# Altium project PLL.PrjPcb
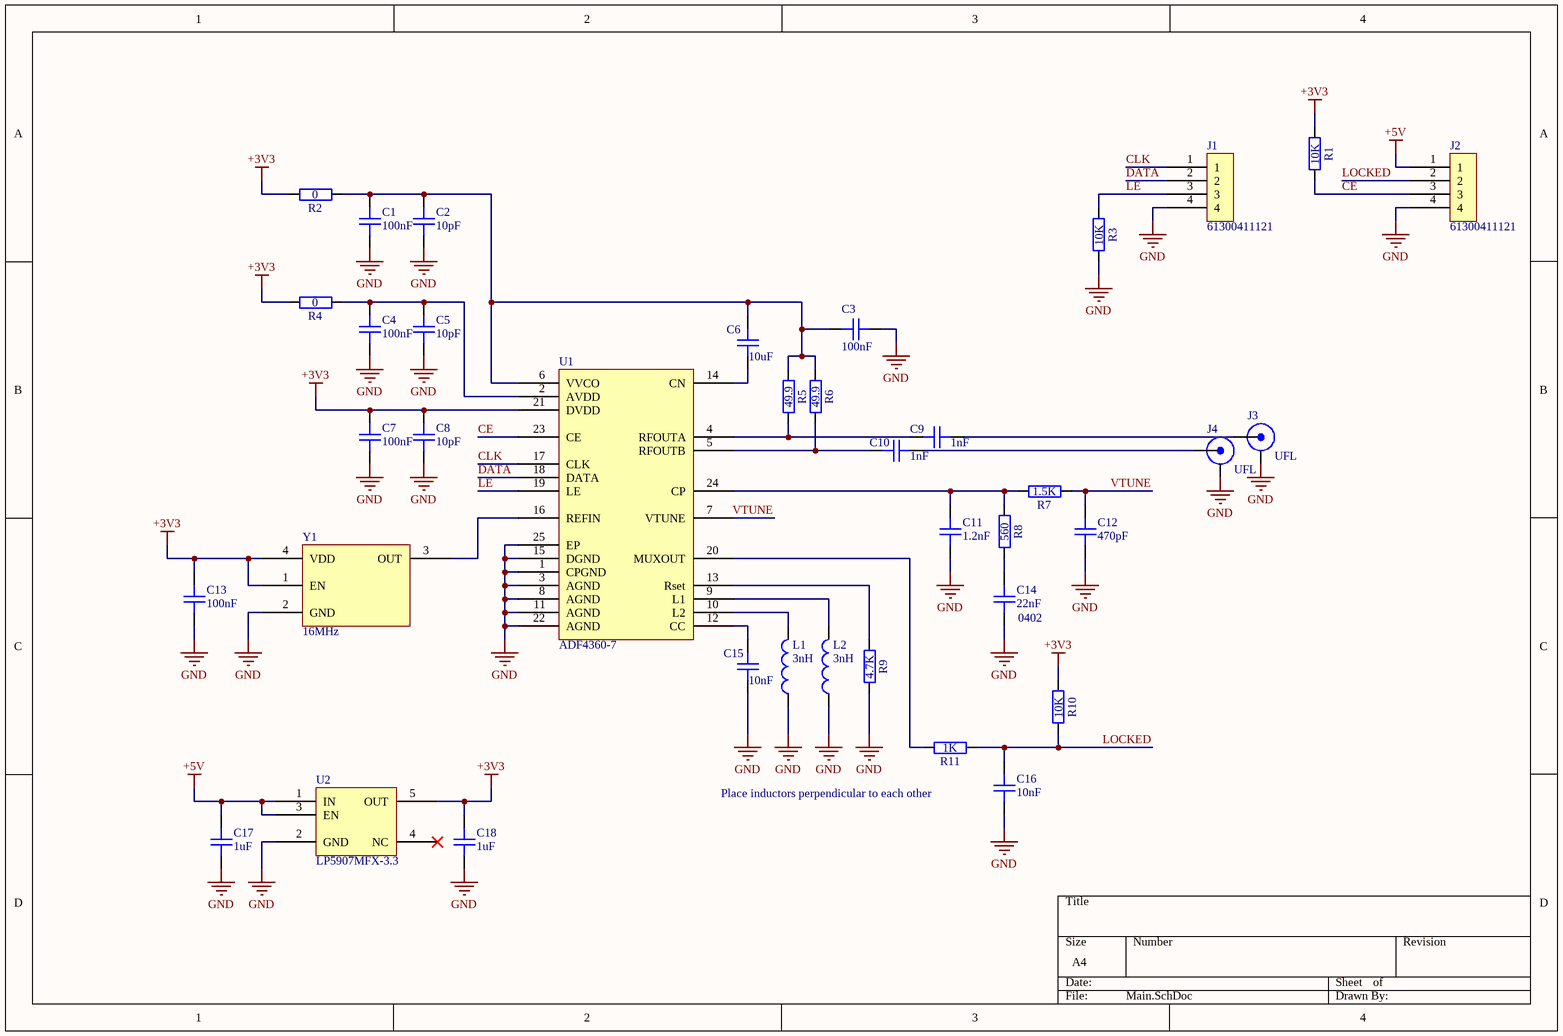
[diagram p0: Main.SchDoc]
1 sheet, 38 parts. Net scope: global (net labels, ports and power ports of the same name join across sheets).
Board file: PLL.PcbDoc

## Sheet Main.SchDoc
size A4

### Parts
C1  value 100nF  [GEN_C_0402]  (hidden comment: CAP 100nF 16V X7R 0402)
C2  10pF  [GEN_C_0402]
C3  value 100nF  [GEN_C_0402]  (hidden comment: CAP 100nF 16V X7R 0402)
C4  value 100nF  [GEN_C_0402]  (hidden comment: CAP 100nF 16V X7R 0402)
C5  10pF  [GEN_C_0402]
C6  value 10uF  [GEN_C_0603]  (hidden comment: CAP 10uF 10V X5R 0603)
C7  value 100nF  [GEN_C_0402]  (hidden comment: CAP 100nF 16V X7R 0402)
C8  10pF  [GEN_C_0402]
C9  value 1nF  [GEN_C_0402]  (hidden comment: CAP 1nF 50V X7R 0402)
C10  value 1nF  [GEN_C_0402]  (hidden comment: CAP 1nF 50V X7R 0402)
C11  1.2nF  [GEN_C_0603]
C12  470pF  [GEN_C_0402]
C13  value 100nF  [GEN_C_0402]  (hidden comment: CAP 100nF 16V X7R 0402)
C14  value 22nF  Package: 0402  [GEN_C_0402]  (hidden comment: CAP 22nF 25V X7R 0402)
C15  value 10nF  [GEN_C_0402]  (hidden comment: CAP 10nF 50V X7R 0402)
C16  value 10nF  [GEN_C_0402]  (hidden comment: CAP 10nF 50V X7R 0402)
C17  value 1uF  [GEN_C_0402]  (hidden comment: CAP 1uF 25V X5R 0402)
C18  value 1uF  [GEN_C_0402]  (hidden comment: CAP 1uF 25V X5R 0402)
J1  61300411121  [GEN_2.54mm_4_Pin_TH]
J2  61300411121  [GEN_2.54mm_4_Pin_TH]
J3  UFL  [AMP_A-1JB]
J4  UFL  [AMP_A-1JB]
L1  3nH  [GEN_L_0402]
L2  3nH  [GEN_L_0402]
R1  value 10K  [GEN_R_0402]  (hidden comment: RES 10K OHM 1% 1/10W 0402)
R2  0  [GEN_R_0402]
R3  value 10K  [GEN_R_0402]  (hidden comment: RES 10K OHM 1% 1/10W 0402)
R4  0  [GEN_R_0402]
R5  49.9  [GEN_R_0402]
R6  49.9  [GEN_R_0402]
R7  1.5K  [GEN_R_0402]
R8  560  [GEN_R_0402]
R9  value 4.7K  [GEN_R_0402]  (hidden comment: RES 4.7K OHM 1% 1/10W 0402)
R10  value 10K  [GEN_R_0402]  (hidden comment: RES 10K OHM 1% 1/10W 0402)
R11  value 1K  [GEN_R_0402]  (hidden comment: RES 1K OHM 1% 1/10W 0402)
U1  ADF4360-7  [AD_QFN24_CP-24-14]
U2  LP5907MFX-3.3  [GEN_SOT23_5_950_2900X1600X1450]
Y1  16MHz  [ECS_TXO-2016]

### Nets
+3V3: C7.2 C8.2 C13.1 C18.2 R1.1 R2.1 R4.1 R10.1 U1.21(DVDD) U2.5(OUT) Y1.1(EN) Y1.4(VDD)
+5V: C17.2 J2.1 U2.1(IN) U2.3(EN)
GND: C1.1 C2.1 C3.1 C4.1 C5.1 C7.1 C8.1 C11.1 C12.1 C13.2 C14.1 C15.1 C16.1 C17.1 C18.1 J1.4 J2.4 J3.2(SHIELD) J4.2(SHIELD) L1.1 L2.1 R3.2 R9.1 U1.1(CPGND) U1.3(AGND) U1.8(AGND) U1.11(AGND) U1.15(DGND) U1.22(AGND) U1.25(EP) U2.2(GND) Y1.2(GND)
CE: J2.3 R1.2 U1.23(CE)
CLK: J1.1 U1.17(CLK)
DATA: J1.2 U1.18(DATA)
LE: J1.3 R3.1 U1.19(LE)
LOCKED: C16.2 J2.2 R10.2 R11.2
VTUNE: C12.2 R7.2 U1.7(VTUNE)
NetC1_2: C1.2 C2.2 C3.2 C6.2 R2.2 R5.2 R6.2 U1.6(VVCO)
NetC4_2: C4.2 C5.2 R4.2 U1.2(AVDD)
NetC6_1: C6.1 U1.14(CN)
NetC9_1: C9.1 J3.1(Signal)
NetC9_2: C9.2 R5.1 U1.4(RFOUTA)
NetC10_1: C10.1 J4.1(Signal)
NetC10_2: C10.2 R6.1 U1.5(RFOUTB)
NetC11_2: C11.2 R7.1 R8.2 U1.24(CP)
NetC14_2: C14.2 R8.1
NetC15_2: C15.2 U1.12(CC)
NetL1_2: L1.2 U1.10(L2)
NetL2_2: L2.2 U1.9(L1)
NetR9_2: R9.2 U1.13(Rset)
NetR11_1: R11.1 U1.20(MUXOUT)
NetU1_16: U1.16(REFIN) Y1.3(OUT)

Not connected (* = marked no-connect by the designer): U2 4(NC)*

### Notes on the sheet
- (near C16) Place inductors perpendicular to each other

### Library data of the parts
C2 C5 C8 = CAP 10pF 50V C0G 0402: Temperature Coefficient: C0G; Voltage Rating: 50V; Package: 0402; Value: 10pF; Supplier 1: Digi-Key; Supplier Part Number 1: 1276-1139-1-ND
C11 = CAP 1.2nF 50V C0G 0603: Voltage Rating: 50V; Temperature Coefficient: C0G; Package: 0603; Value: 1.2nF; Supplier 1: Digi-Key; Supplier Part Number 1: 490-1453-1-ND
C12 = CAP 470pF 50V C0G 0402: Temperature Coefficient: C0G; Voltage Rating: 50V; Package: 0402; Supplier 1: Digi-Key; Supplier Part Number 1: 490-1297-1-ND; Value: 470pF
J1 J2 = CONN 2.54mm 4 Pin TH: Supplier 1: Digi-Key; Supplier Part Number 1: 732-5317-ND
J3 J4 = UFL Jack SMD: Supplier 1: Digi-Key; Supplier Part Number 1: ARF1579CT-ND
L1 L2 = IND 3nH +/-0.05nH 0402: Value: 3nH; Supplier 1: Digi-Key; Supplier Part Number 1: 490-8434-1-ND
R1 R3 R10 = RES 10K OHM 1% 1/10W 0402: Power Rating: 0.1W; Tolerance: 1%; Package: 0402; Supplier 1: Digi-Key; Supplier Part Number 1: P10.0KLCT-ND
R2 R4 = RES 0 OHM 1/16W 0402: Power Rating: 0.0625W; Package: 0402; Supplier 1: Digi-Key; Supplier Part Number 1: 311-0.0JRCT-ND; Value: 0
R5 R6 = RES 49.9 OHM 1% 1/10W 0402: Tolerance: 1%; Power Rating: 0.1W; Package: 0402; Supplier 1: Digi-Key; Supplier Part Number 1: P49.9LCT-ND; Value: 49.9
R7 = RES 1.5K OHM 1% 1/16W 0402: Tolerance: 1%; Power Rating: 0.0625W; Package: 0402; Value: 1.5K; Supplier 1: Digi-Key; Supplier Part Number 1: 311-1.50KLRCT-ND
R8 = RES 560 OHM 1% 1/16W 0402: Tolerance: 1%; Power Rating: 0.0625W; Package: 0402; Value: 560; Supplier 1: Digi-Key; Supplier Part Number 1: 311-560LRCT-ND
R9 = RES 4.7K OHM 1% 1/10W 0402: Power Rating: 0.1W; Tolerance: 1%; Package: 0402; Supplier 1: Digi-Key; Supplier Part Number 1: P4.70KLCT-ND
R11 = RES 1K OHM 1% 1/10W 0402: Power Rating: 0.1W; Tolerance: 1%; Package: 0402; Supplier 1: Digi-Key; Supplier Part Number 1: P1.00KLCT-ND
U1 = IC PLL ADF4360-7: Supplier 1: Digi-Key; Supplier Part Number 1: ADF4360-7BCPZRL7CT-ND
U2 = IC LDO LP5907MFX-3.3: Supplier 1: Digi-Key; Supplier Part Number 1: 296-38557-1-ND
Y1 = OSC 16MHz ECS-TXO-2016: Supplier 1: Digi-Key; Supplier Part Number 1: XC3161CT-ND
C1 C3 C4 C7 C13 = CAP 100nF 16V X7R 0402: Package: 0402; Voltage Rating: 16V; Supplier 1: Digi-Key; Supplier Part Number 1: 490-4759-1-ND
C6 = CAP 10uF 10V X5R 0603: Package: 0402; Voltage Rating: 10V; Supplier 1: Digi-Key; Supplier Part Number 1: 490-10474-1-ND
C9 C10 = CAP 1nF 50V X7R 0402: Package: 0402; Voltage Rating: 50V; Supplier 1: Digi-Key; Supplier Part Number 1: 490-4761-1-ND
C14 = CAP 22nF 25V X7R 0402: Voltage Rating: 25V; Supplier 1: Digi-Key; Supplier Part Number 1: 490-10699-1-ND
C15 C16 = CAP 10nF 50V X7R 0402: Package: 0402; Voltage Rating: 50V; Supplier 1: Digi-Key; Supplier Part Number 1: 490-4762-1-ND
C17 C18 = CAP 1uF 25V X5R 0402: Package: 0402; Voltage Rating: 25V; Supplier 1: Digi-Key; Supplier Part Number 1: 490-10017-1-ND